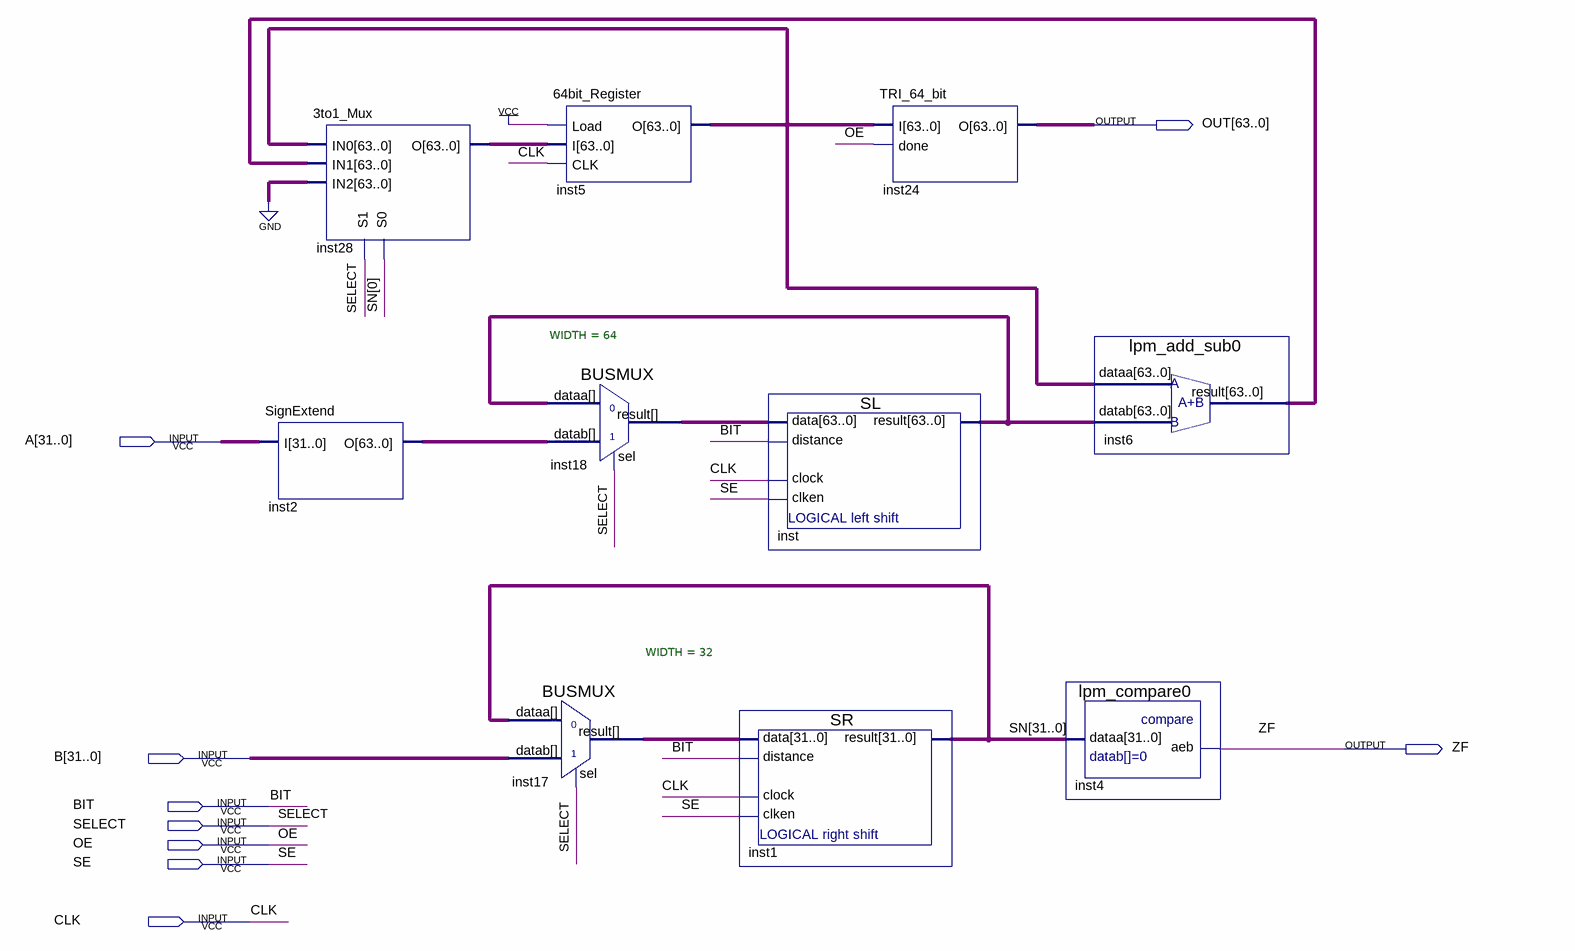
[diagram p0: schematic sheet]
// Quartus schematic DATAPATH.bdf as structural Verilog: 10 symbols, 9 pins
module DATAPATH (
  input  [31:0] A,
  input  [31:0] B,
  input  BIT,
  input  SELECT,
  input  OE,
  input  SE,
  input  CLK,
  output [63:0] OUT,
  output ZF
);

  wire [31:0] inst17_result, SN;
  wire [63:0] inst2_o, inst5_o, inst6_result, inst18_result, inst28_o, inst_result;

  \3to1_Mux  inst28 (.IN0(inst5_o), .IN1(inst6_result), .IN2({64{1'b0}}), .S1(SELECT), .S0(SN[0]), .O(inst28_o));
  SignExtend inst2 (.I(A), .O(inst2_o));
  \64bit_Register  inst5 (.Load(1'b1), .I(inst28_o), .CLK(CLK), .O(inst5_o));
  BUSMUX #(.WIDTH(64)) inst18 (.datab(inst2_o), .sel(SELECT), .dataa(inst_result), .result(inst18_result));
  BUSMUX #(.WIDTH(32)) inst17 (.datab(B), .sel(SELECT), .dataa(SN), .result(inst17_result));
  SL inst (.data(inst18_result), .distance(BIT), .clock(CLK), .clken(SE), .result(inst_result));
  SR inst1 (.data(inst17_result), .distance(BIT), .clock(CLK), .clken(SE), .result(SN));
  TRI_64_bit inst24 (.I(inst5_o), .done(OE), .O(OUT));
  lpm_add_sub0 inst6 (.dataa(inst5_o), .datab(inst_result), .result(inst6_result));
  lpm_compare0 inst4 (.dataa(SN), .aeb(ZF));
endmodule
